# EAGLE design NTS2 (EAGLE 6.4)
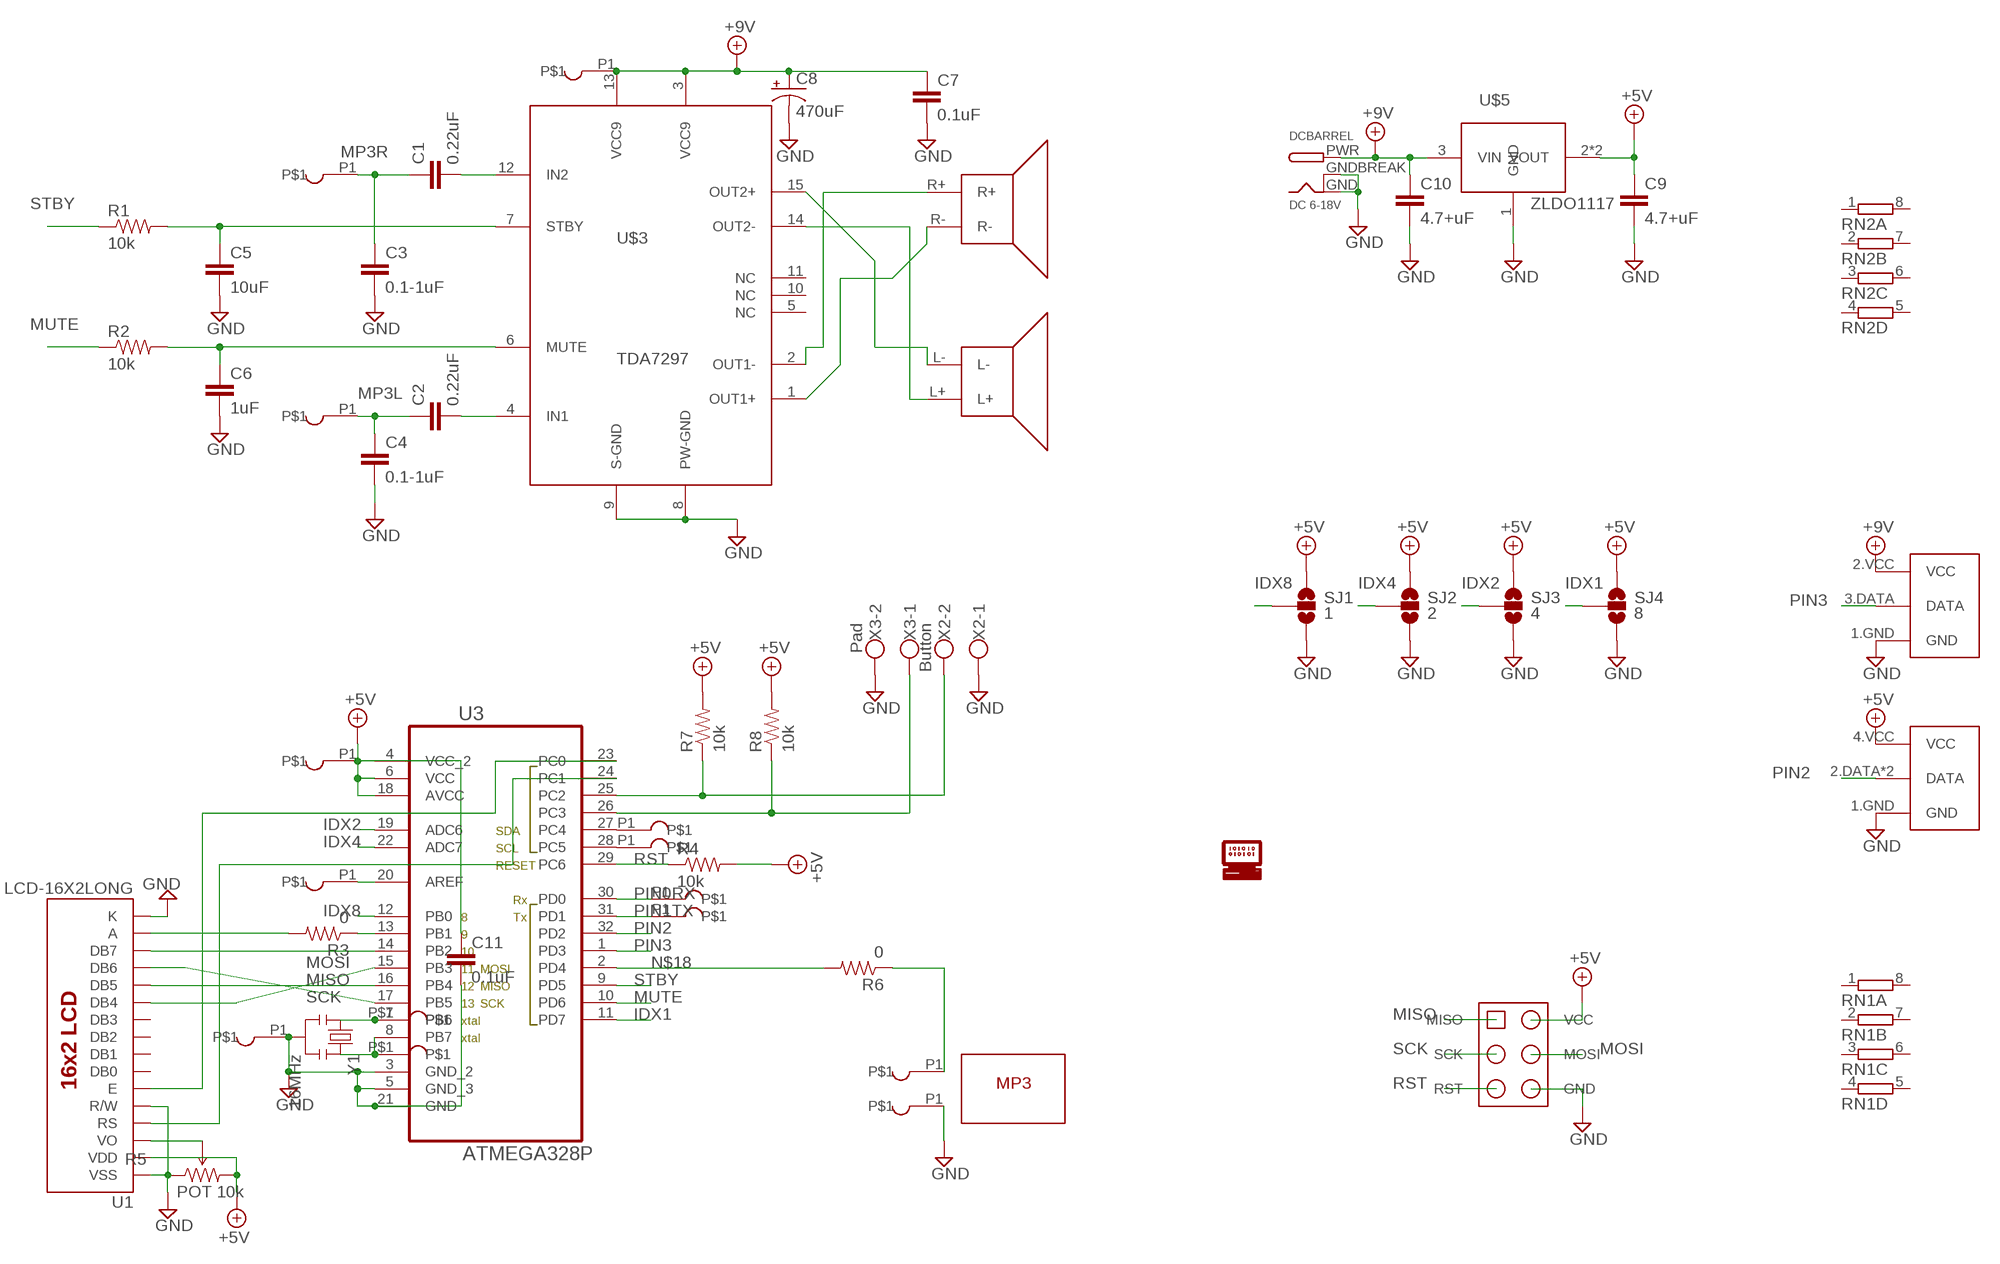
[diagram p0: schematic, sheet 1]

## Parts
AREF  AREF  PROTO-HOLENOSILK  [JMP1]
C1  0.22uF  CAP0805-XL  [0805-XL]
C2  0.22uF  CAP0805-XL  [0805-XL]
C3  0.1-1uF  CAP0805-XL  [0805-XL]
C4  0.1-1uF  CAP0805-XL  [0805-XL]
C5  10uF  CAP0805-XL  [0805-XL]
C6  1uF  CAP0805-XL  [0805-XL]
C7  0.1uF  CAP0805-XL  [0805-XL]
C8  470uF  CAP_POLHORR  [CAP-PTH-200-POL-HOR-R-600]
C9  4.7+uF  CAP1206  [1206]
C10  4.7+uF  CAP0805-XL  [0805-XL]
C11  0.1uF  CAP0805-XL  [0805-XL]
DCBARREL  DC 6-18V  DCBARRELPTH  [DCJACK_2MM_PTH]
GND  GND  PROTO-HOLENOSILK  [JMP1]
MP3+  M+  PROTO-HOLESILK-RECT  [JMP1-RECT]
MP3-  M-  PROTO-HOLESILK-RECT  [JMP1-RECT]
MP3-L  L  PROTO-HOLESILK-RECT  [JMP1-RECT]
MP3-R  R  PROTO-HOLESILK-RECT  [JMP1-RECT]
PB6  PB6  PROTO-HOLESMD100  [JMP1-SMD-100]
PB7  PB7  PROTO-HOLESMD100  [JMP1-SMD-100]
PC4  A4  PROTO-HOLENOSILK  [JMP1]
PC5  A5  PROTO-HOLENOSILK  [JMP1]
PD0  Rx  PROTO-HOLENOSILK  [JMP1]
PD1  Tx  PROTO-HOLENOSILK  [JMP1]
R1  10k  RESISTOR0805-XL  [0805-XL]
R2  10k  RESISTOR0805-XL  [0805-XL]
R3  0  RESISTOR1206  [1206]
R4  10k  RESISTOR0805-XL  [0805-XL]
R5  POT 10k  TRIMPOTPTH  [TRIM_POT_PTH]
R6  0  RESISTOR1206  [1206]
R7  10k  RESISTOR0805-XL  [0805-XL]
R8  10k  RESISTOR0805-XL  [0805-XL]
RN1  4R-NCAT16  [CAT16]
RN2  4R-N0402ARV341  [4X0402ARV341]
SJ1  1  JUMPER_2WAYBIN-PTH  [SJ_2_BIN-PTH]
SJ2  2  JUMPER_2WAYBIN-PTH  [SJ_2_BIN-PTH]
SJ3  4  JUMPER_2WAYBIN-PTH  [SJ_2_BIN-PTH]
SJ4  8  JUMPER_2WAYBIN-PTH  [SJ_2_BIN-PTH]
U1  LCD-16X2LONG  [LCD-16X2-LONG]
U3  ATMEGA328P  ATMEGA328P-AUQFP-LONG-DIA  [QFP80P900X900X120-32N-LD]
U$1  OUTLINE-MP3-MDM  [OUTLINE-MP3-MDM]
U$2  HEAD-2X3-ISPISP6NLL  [HEADER2X3-PTH-NOLABEL-LONG]
U$3  TDA7297  TDA7297-SINK  [TDA7297]
U$4  SPEAKERSPTH  [SPEAKER-5105]
U$5  ZLDO1117  VREGZLDO1117  [SOT223-3-L]
U$6  RF-TRANSMITTER  [RF-TRANSMIT]
U$7  RF-RECEIVER  [RF-RECEIVER]
U$8  LOGO_HM512  [LOGO_HM_512]
VCC  VCC  PROTO-HOLENOSILK  [JMP1]
VIN  Vin  PROTO-HOLENOSILK  [JMP1]
X2  Button  CON-SCREW2  [CON-SCREW2]
X3  Pad  CON-SCREW2  [CON-SCREW2]
Y1  16MHz  RESONATOR8MHZ  [SMD-RESONATOR-320-130-PRQC]

## Nets
+5V [VCC]: C9.1 C11.1 R4.2 R5.3(CW) R7.2 R8.2 SJ1.1 SJ2.1 SJ3.1 SJ4.1 U1.2(VDD) U3.4(VCC_2) U3.6(VCC) U3.18(AVCC) U$2.VCC U$5.2(VOUT) U$5.4(VOUT) U$7.4.VCC(VCC) VCC.P1
+9V [Vin]: C7.1 C8.2+(+) C10.1 DCBARREL.PWR U$3.3(VCC9) U$3.13(VCC9) U$5.3(VIN) U$6.2.VCC(VCC) VIN.P1
AREF: AREF.P1 U3.20(AREF)
GND [GROUND]: C3.2 C4.2 C5.2 C6.2 C7.2 C8.1-(-) C9.2 C10.2 C11.2 DCBARREL.GND DCBARREL.GNDBREAK GND.P1 MP3-.P1 R5.1(CCW) SJ1.3 SJ2.3 SJ3.3 SJ4.3 U1.1(VSS) U1.5(R/W) U1.16(K) U3.3(GND_2) U3.5(GND_3) U3.21(GND) U$2.GND U$3.8(PW-GND) U$3.9(S-GND) U$5.1(GND) U$6.1.GND(GND) U$7.1.GND(GND) X2.1 X3.2 Y1.2.GND
IDX1: SJ4.2(2.C) U3.11(PD7)
IDX2: SJ3.2(2.C) U3.19(ADC6)
IDX4: SJ2.2(2.C) U3.22(ADC7)
IDX8: SJ1.2(2.C) U3.12(PB0)
MISO: U1.12(DB5) U3.16(PB4) U$2.MISO
MOSI: U1.11(DB4) U3.15(PB3) U$2.MOSI
MP3L: C2.1 C4.1 MP3-L.P1
MP3R: C1.1 C3.1 MP3-R.P1
MUTE: R2.1 U3.10(PD6)
N$1 [Audio]: U$3.15(OUT2+) U$4.L-
N$2 [Audio]: U$3.14(OUT2-) U$4.L+
N$3 [Audio]: U$3.2(OUT1-) U$4.R+
N$4 [Audio]: U$3.1(OUT1+) U$4.R-
N$5: R7.1 U3.25(PC2) X2.2
N$6: C1.2 U$3.12(IN2)
N$7: R8.1 U3.26(PC3) X3.1
N$8: C2.2 U$3.4(IN1)
N$9: C6.1 R2.2 U$3.6(MUTE)
N$10: C5.1 R1.2 U$3.7(STBY)
N$11: R3.1 U3.13(PB1)
N$12: U1.14(DB7) U3.14(PB2)
N$13: PB6.P$1 U3.7(PB6) Y1.1
N$14: PB7.P$1 U3.8(PB7) Y1.3
N$15: R5.2(WIPER) U1.3(VO)
N$16: U1.6(E) U3.23(PC0)
N$17: U1.4(RS) U3.24(PC1)
N$18: R6.2 U3.2(PD4)
N$19: R3.2 U1.15(A)
N$20: MP3+.P1 R6.1
N$22: PC4.P1 U3.27(PC4)
N$23: PC5.P1 U3.28(PC5)
PIN0RX: PD0.P1 U3.30(PD0)
PIN1TX: PD1.P1 U3.31(PD1)
PIN2: U3.32(PD2) U$7.2.DATA(DATA) U$7.3.DATA(DATA)
PIN3: U3.1(PD3) U$6.3.DATA(DATA)
RST: R4.1 U3.29(PC6) U$2.RST
SCK: U1.13(DB6) U3.17(PB5) U$2.SCK
STBY: R1.1 U3.9(PD5)
Unconnected: RN1.1 RN1.2 RN1.3 RN1.4 RN1.5 RN1.6 RN1.7 RN1.8 RN2.1 RN2.2 RN2.3 RN2.4 RN2.5 RN2.6 RN2.7 RN2.8 U1.7(DB0) U1.8(DB1) U1.9(DB2) U1.10(DB3) U$3.5(NC) U$3.10(NC) U$3.11(NC)

## Library data of the parts
AREF GND MP3+ MP3- MP3-L MP3-R PB6 PB7 PC4 PC5 PD0 PD1 VCC VIN = Cano:PROTO-HOLE
C1-C7 C9-C11 = Cano:CAP: Capacitor Standard 0603 ceramic capacitor, and 0.1" leaded capacitor.
C8 = Cano:CAP_POL: Capacitor Polarized These are standard SMD and PTH capacitors. Normally 10uF, 47uF, and 100uF in electrolytic and tantalum varieties. Always verify the external diameter of the through hole cap, it varies with capacity, voltage, and manufacturer. The EIA devices should be standard.
DCBARREL = Cano:DCBARREL: 2.0mm DC Barrel Jack DCJACK_2MM_PTH - Through Hole Jack (4UConnector: 05537)
R1-R4 R6-R8 = Cano:RESISTOR: Resistor Basic schematic elements and footprints for 0603, 1206, and PTH resistors.
R5 = Cano:TRIMPOT: Various small potentiometers for "set-and-forget" applications
RN1 RN2 = resistor-dil:4R-N: Array Chip Resistor Source: RS Component / Phycomp; OC_FARNELL: unknown; OC_NEWARK: unknown
SJ1-SJ4 = Cano:JUMPER_2WAY: Solder Jumper 2 way solder jumper
U1 = Cano:LCD-16X2: Standard text-only 16x2 parallel input LCD
U3 = Cano:ATMEGA328P-AU: 8-bit Microcontroller with In-System Programmable Flash
U$1 = Cano:OUTLINE-MP3-MDM
U$2 = Cano:HEAD-2X3-ISP
U$3 = Cano:TDA7297
U$4 = Cano:SPEAKERS
U$5 = Cano:VREG
U$6 = Cano:RF-TRANSMITTER
U$7 = Cano:RF-RECEIVER
U$8 = Cano:LOGO_HM
X2 X3 = Cano:CON-SCREW2: WAGO SCREW CLAMP; MPN: 237-102; OC_FARNELL: unknown; OC_NEWARK: 70K9898
Y1 = Cano:RESONATOR: Resonator Small SMD resonator. Used, eg, on the Arduino Pro/ Pro Mini boards. 8MHz- XTAL-08895 16MHz- XTAL-08900; PROD_ID: XTAL-08895; VALUE: 8MHZ

## Net classes
1 GROUND: width 0.406 mm
2 VCC: width 0.406 mm
3 Vin: width 1.626 mm
4 Audio: width 0.813 mm, clearance 0.813 mm to class 0, clearance 0.813 mm to class 1, clearance 0.813 mm to class 2, clearance 0.813 mm to class 3, clearance 0.813 mm

## Board
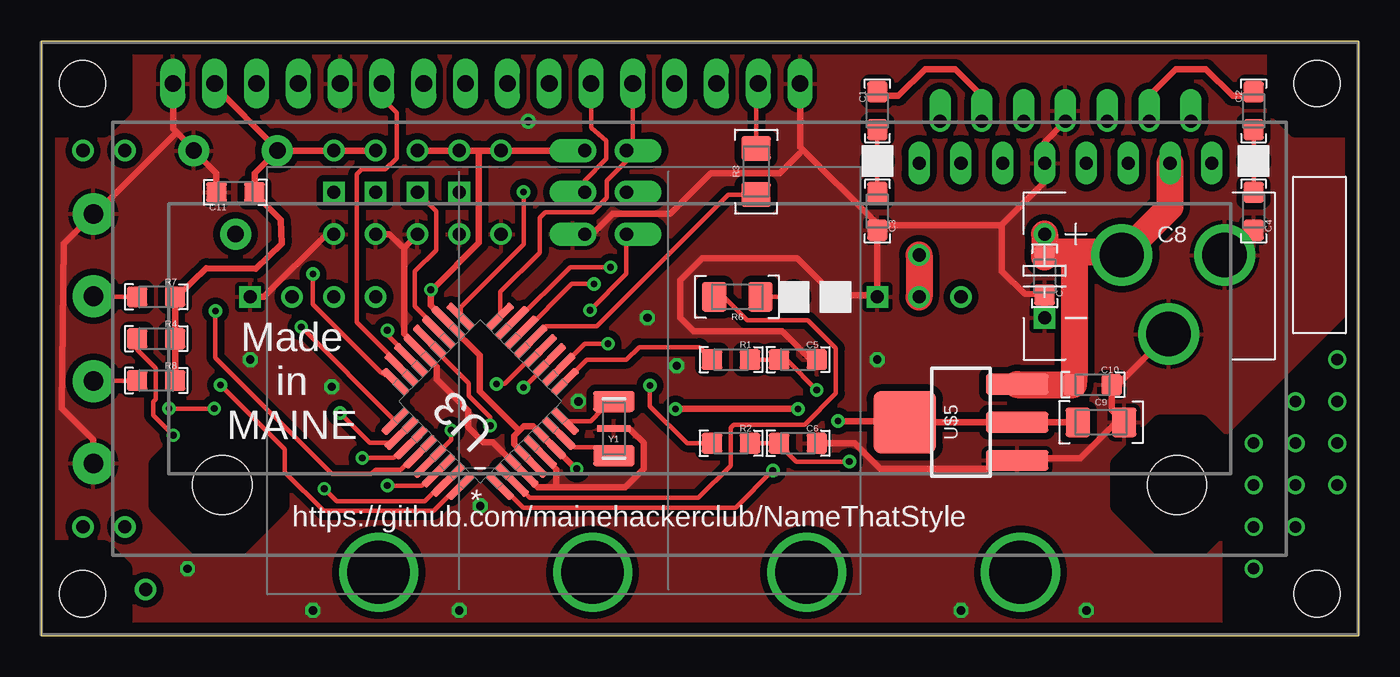
[diagram p1: board, top side]
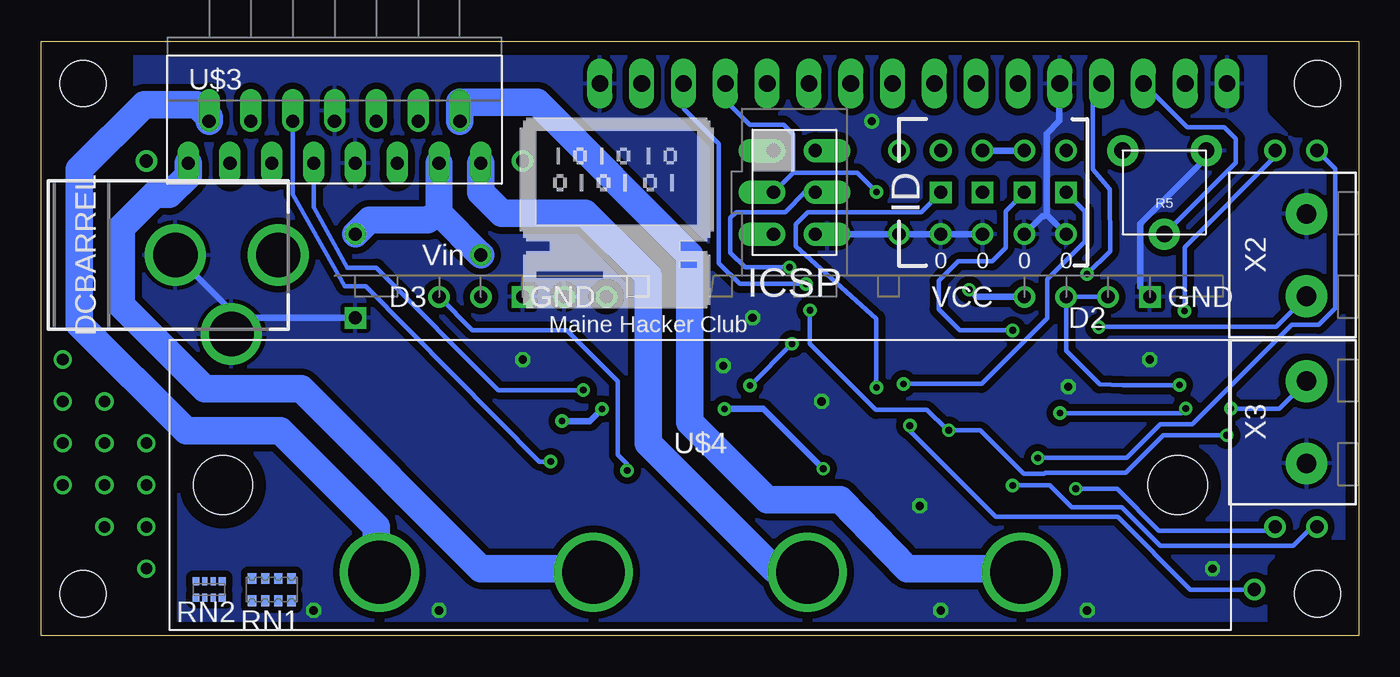
[diagram p2: board, bottom side, seen from below]

Size 80.05 x 36.11 mm. Coordinates in mm from the lower left corner, seen from the top.
Outline: 0,0 80.05,0 80.05,36.11 0,36.11 0,0
Copper layers (1*16): Top 0.035mm / dielectric 1.5mm / Bottom 0.035mm
Design rules "cano": minimum track width 11mil, minimum drill 16mil, track to track 12mil, track to pad 13mil, pad to pad 8mil, via to via 24mil, smd to smd 8mil, copper to edge 32mil, drill to drill 8mil, minimum pad ring 10mil, minimum via ring 8mil, stop-mask expansion 4mil, vias tented up to drill 0mil, thermal gap 10mil
tRestrict: area 72.4,0.3 to 80,19.3
bRestrict: area 72.4,0.3 to 80,19.3
vRestrict: area 35.6,18 to 52.1,32; area 14,5.8 to 67.3,8.4

### Footprints (pad centres in the part's own frame; a part is rotated, then mirrored left to right if it is on the bottom)
JMP1 = drill 0.8: P1 0,0
0805-XL = smd 1.27 x 1.27: 1 -1.154,0; 2 1.154,0
CAP-PTH-200-POL-HOR-R-600 = drill 0.8 square: 1- -5.08,-2.54 | drill 0.8: 2+ -5.08,2.54
1206 = smd 1.5 x 1.8: 1 -1.4,0; 2 1.4,0
DCJACK_2MM_PTH = drill 2.7: GND 0,-0.27; GNDBREAK 4.8,3.13; PWR 0,5.98
JMP1-RECT = drill 0.8: P1 0,0
JMP1-SMD-100 = smd 2.54 x 1.27: P$1 0,0
TRIM_POT_PTH = drill 1 pad 1.88: 1 -2.54,-2.54; 2 0,2.54; 3 2.54,-2.54
CAT16 = smd 0.5 x 0.65: 1 -1.2,-0.675; 2 -0.4,-0.675; 3 0.4,-0.675; 4 1.2,-0.675; 5 1.2,0.675; 6 0.4,0.675; 7 -0.4,0.675; 8 -1.2,0.675
4X0402ARV341 = smd 0.4 x 0.5: 1 -0.8,-0.5; 4 0.8,-0.5; 5 0.8,0.5; 8 -0.8,0.5 | smd 0.3 x 0.5: 2 -0.25,-0.5; 3 0.25,-0.5; 6 0.25,0.5; 7 -0.25,0.5
SJ_2_BIN-PTH = drill 0.8: 1 0,2.54; 3 0,-2.54 | drill 0.8 square: 2 0,0
LCD-16X2-LONG = drill 1.016 long: 1 -32,15.5; 2 -29.46,15.5; 3 -26.92,15.5; 4 -24.38,15.5; 5 -21.84,15.5; 6 -19.3,15.5; 7 -16.76,15.5; 8 -14.22,15.5; 9 -11.68,15.5; 10 -9.14,15.5; 11 -6.6,15.5; 12 -4.06,15.5; 13 -1.52,15.5; 14 1.02,15.5; 15 3.56,15.5; 16 6.1,15.5 | hole 2.8: -37.5,15.5; -37.5,-15.5; 37.5,15.5; 37.5,-15.5
QFP80P900X900X120-32N-LD = smd 2.032 x 0.457: 1 -4.496,2.794; 8 -4.496,-2.794; 17 4.496,-2.794; 24 4.496,2.794 | smd 2.54 x 0.457: 2 -4.75,2.007; 3 -4.75,1.194; 4 -4.75,0.406; 5 -4.75,-0.406; 6 -4.75,-1.194; 7 -4.75,-2.007; 18 4.75,-2.007; 19 4.75,-1.194; 20 4.75,-0.406; 21 4.75,0.406; 22 4.75,1.194; 23 4.75,2.007 | smd 0.457 x 2.032: 9 -2.794,-4.496; 16 2.794,-4.496; 25 2.794,4.496; 32 -2.794,4.496 | smd 0.457 x 2.54: 10 -2.007,-4.75; 11 -1.194,-4.75; 12 -0.406,-4.75; 13 0.406,-4.75; 14 1.194,-4.75; 15 2.007,-4.75; 26 2.007,4.75; 27 1.194,4.75; 28 0.406,4.75; 29 -0.406,4.75; 30 -1.194,4.75; 31 -2.007,4.75
HEADER2X3-PTH-NOLABEL-LONG = drill 0.8 pad 1.422 offset: GND 1.27,-2.54; MISO -1.27,2.54; MOSI 1.27,0; RST -1.27,-2.54; SCK -1.27,0; VCC 1.27,2.54
TDA7297 = drill 0.8 long: 1 2.54,-8.89; 3 2.54,-6.35; 5 2.54,-3.81; 7 2.54,-1.27; 9 2.54,1.27; 11 2.54,3.81; 13 2.54,6.35; 15 2.54,8.89 | drill 0.8 offset: 2 0,-7.62; 4 0,-5.08; 6 0,-2.54; 8 0,0; 10 0,2.54; 12 0,5.08; 14 0,7.62
SPEAKER-5105 = drill 3.8: L+ -19.5,5.3; L- -6.5,5.3; R+ 19.5,5.3; R- 6.5,5.3 | hole 3.6: 29,0; -29,0
SOT223-3-L = smd 1.27 x 3.81: 1 -2.311,-3.417; 2 0,-3.417; 3 2.311,-3.417 | smd 3.81 x 3.81: 4 0,3.417
RF-TRANSMIT = drill 0.8 square: 1.GND -2.54,0 | drill 0.8: 2.VCC 0,0; 3.DATA 2.54,0
RF-RECEIVER = drill 0.8 square: 1.GND -11.43,0 | drill 0.8: 2.DATA -8.89,0; 3.DATA -6.35,0; 4.VCC -3.81,0
CON-SCREW2 = drill 1.194 pad 2.54: 1 -2.5,0; 2 2.5,0
SMD-RESONATOR-320-130-PRQC = smd 0.4 x 2: 1 -1.2,0; 2.GND 0,0; 3 1.2,0

### Placement (x,y rotation side)
AREF  6.35,2.79 0 top
C1  50.8,31.88 90 top
C2  73.66,31.88 90 top
C3  50.8,25.78 270 top
C4  73.66,25.78 270 top
C5  45.97,16.76 0 top
C6  45.97,11.68 0 top
C7  60.96,21.84 270 top
C8  66.04,21.84 0 top
C9  64.39,12.95 0 top
C10  63.88,15.24 0 top
C11  11.81,26.92 180 top
DCBARREL  71.63,23.11 270 bottom
GND  27.94,24.38 270 top
MP3+  45.72,20.57 90 top
MP3-  48.26,20.57 90 top
MP3-L  73.66,28.83 0 top
MP3-R  50.8,28.83 180 top
PB6  34.8,10.92 0 top
PB7  34.8,14.22 0 top
PC4  2.54,29.46 90 top
PC5  5.08,29.46 90 top
PD0  2.54,6.6 270 top
PD1  5.08,6.6 270 top
R1  41.91,16.76 0 top
R2  41.91,11.68 0 top
R3  43.43,28.19 90 top
R4  6.99,18.03 0 top
R5  11.81,26.92 180 bottom
R6  42.29,20.57 180 top
R7  6.99,20.57 0 top
R8  6.99,15.49 0 top
RN1  66.04,2.79 0 bottom
RN2  69.85,2.79 0 bottom
SJ1  17.78,26.92 0 bottom
SJ2  20.32,26.92 0 bottom
SJ3  22.86,26.92 0 bottom
SJ4  25.4,26.92 0 bottom
U1  40.01,18.03 0 top
U3  26.67,14.22 135 top
U$1  31.75,15.49 180 top
U$2  34.29,26.92 0 bottom
U$3  62.23,31.24 270 bottom
U$4  40.01,9.14 180 bottom
U$5  55.88,12.95 90 top
U$6  53.34,20.57 180 bottom
U$7  24.13,20.57 180 bottom
U$8  45.21,25.65 0 bottom
VCC  27.94,29.46 270 top
VIN  53.34,23.11 90 top
X2  3.17,23.11 270 bottom
X3  3.17,12.95 270 bottom
Y1  34.8,12.57 90 top

### Tracks (layer width: path | path; a pad name or v marks a point on that pad's centre or on a via)
+5V  (via drill 0.41)
  Top 0.406: SJ2.1 SJ1.1 R5.3 | SJ3.1 SJ4.1 26.59,29.46 | 26.59,29.46 VCC.P1 U$2.VCC | R8.2 8.15,15.49 8.15,18.03 R4.2 8.15,18.21 8.15,20.57 R7.2 8.33,20.68 10.03,22.33 13.03,22.28 14.61,23.8 14.55,25.27 13.08,26.75 C11.1 12.98,26.92 12.98,28.09 R5.3 | U1.2 10.57,33.53 10.57,33.32 14.25,29.64 R5.3 | C9.1 U$5.2 U$5.4 52.27,13.03 v48.41,13.03 | 29.05,12.43 29.31,12.7 29.9,12.7 30.86,11.73 U3.6 31.04,11.58 32.49,10.13 v32.54,10.13 | 29.05,12.43 28.75,12.14 28.75,11.63 29.72,10.67 29.72,10.59 U3.4 | 29.05,12.43 26.64,14.83 26.64,17.02 24.74,18.92 U3.18 24.59,19.15 23.67,20.07 v23.67,21.01 23.85,21.11 26.59,23.85 26.59,29.46 | v38.53,13.77 v45.97,13.77
  Bottom 0.406: SJ3.1 SJ2.1 | U$7.4.VCC 23.24,20.57 v23.67,21.01 | v48.41,13.03 46.71,13.03 v45.97,13.77 | v38.53,13.77 36.17,13.77 v32.54,10.13
+9V
  Top 1.626: VIN.P1 U$6.2.VCC | 62.71,15.24 59.31,15.24 U$5.3 | 62.71,15.24 C10.1 | C8.2+ 60.96,23.29 | 60.96,23.29 C7.1 | U$3.3 68.58,26.04 DCBARREL.PWR 64.85,23.29 62.76,23.29 | 62.76,23.29 60.96,23.29 | 62.76,23.29 62.76,16.03 62.71,15.24
  Bottom 1.626: 55.88,25.65 U$3.13 | VIN.P1 55.88,25.65 | C8.2+ 60.1,25.25 56.59,25.25 55.88,25.65
AREF  (via drill 0.41)
  Top 0.279: v27.28,12.75 27.28,13.26 25.98,14.55 25.98,15.34 23.62,17.7 23.62,17.86 U3.20
  Bottom 0.279: v27.28,12.75 27.33,12.5 22.05,7.21 14.66,7.21 10.24,2.79 AREF.P1
GND  (via drill 0.5)
  Top 0.406: C5.2 46.76,16.76 45.03,18.49 39.65,18.49 38.84,19.3 38.84,21.59 40.16,22.91 45.92,22.91 MP3-.P1 48.44,20.68 50.62,20.68 U$6.1.GND C3.2 | 46.13,29.67 46.13,33.53 U1.16 | 46.13,29.67 50.72,25.07 C3.2 | C4.2 73.66,24.87 DCBARREL.GND | C6.2 49.43,11.68 50.98,10.13 57.51,10.13 59.28,10.64 U$5.1 | 59.31,10.67 U$5.1 | U$3.8 60.96,29.97 U$3.9 60.86,28.52 60.86,27.43 58.37,24.94 | C8.1- C7.2 59.74,20.75 58.37,22.12 58.37,24.94 | DCBARREL.GNDBREAK 68.48,18.31 65.51,15.34 65.23,15.34 C10.2 65.05,15.24 65.05,13.69 C9.2 65.41,13.06 63.12,10.77 59.49,10.77 U$5.1 | C3.2 51,24.92 58.19,24.92 58.37,24.94 | C11.2 10.64,26.92 10.64,28.09 R5.1 9.17,29.64 8.24,30.57 | 8.24,30.57 8.03,30.79 8.03,33.53 U1.1 | X3.2 3.17,11.89 1.25,13.82 1.37,23.8 X2.1 3.35,25.68 8.24,30.57 | U$7.1.GND 13.54,20.57 17.35,24.38 SJ1.3 | Y1.2.GND 35.74,12.57 36.6,11.71 36.6,10.13 35.48,9.02 31.29,9.02 | 31.29,9.02 30.18,9.02 29.18,10.01 U3.3 29.03,10.13 27.43,11.73 26.85,11.73 25.93,12.65 25.93,13.66 24.03,15.57 24.03,16.33 23.19,17.17 U3.21 23.01,17.37 22.05,18.34 22.05,23.57 | 31.29,9.02 31.29,10.11 30.33,11.07 U3.5 | SJ3.3 22.05,23.57 | SJ2.3 21.16,24.38 21.87,23.67 22.05,23.57 | U$2.GND 33.48,24.38 34.72,25.63 38.23,25.63 40.69,28.09 44.88,28.09 46.23,29.44 46.2,29.57 46.13,29.67
  Bottom 0.406: C8.1- 67.51,19.3 68.48,18.34 DCBARREL.GNDBREAK 67.92,19.15 71.88,23.11 DCBARREL.GND | 18.97,25.58 18.97,30.48 18.19,31.27 18.19,33.53 U1.5 | SJ1.3 18.97,25.58 | SJ3.3 SJ4.3 GND.P1 U$2.GND | SJ2.3 19.23,25.48 19.15,25.48 18.97,25.58 | R5.1 9.27,29.03 13.28,25.02 13.28,21.16 U$7.1.GND
  other vias: 16.51,1.52 63.5,1.52 29.59,31.24 36.83,19.3 12.7,16.76 17.65,15.11 26.67,7.87 55.88,1.52 25.4,1.52 50.8,16.76 8.89,4.06 38.61,16.38 32.64,14.22
  pour Top (isolate 0.406): 0,0.25 80.01,0.25 80.01,35.81 0,35.81
  pour Bottom (isolate 0.406): 0,0.25 80.01,0.25 80.01,35.81 0,35.81
IDX1  (via drill 0.41)
  Top 0.279: v29.31,15.06 30.86,16.61 30.86,16.71 U3.11
  Bottom 0.279: v29.31,15.06 29.31,19.25 34.21,23.65 34.21,24.99 33.48,25.73 26.59,25.73 SJ4.2
IDX2
  Top 0.279: SJ3.2 24,25.78 24,23.42 22.71,22.12 22.71,20.02 24.16,18.57 24.16,18.44 U3.19
IDX4  (via drill 0.41)
  Top 0.279: v21.03,18.54 21.03,18.29 22.45,16.87 22.45,16.74 U3.22
  Bottom 0.279: v21.03,18.54 24.23,18.54 25.53,19.84 25.53,21.54 24.33,22.73 22.28,22.73 21.46,23.55 21.46,25.78 SJ2.2
IDX8  (via drill 0.41)
  Top 0.279: v27.66,15.29 28.17,15.29 30.15,17.27 30.3,17.27 U3.12
  Bottom 0.279: v27.66,15.29 22.91,15.29 18.92,19.28 18.92,21.64 16.64,23.93 16.64,25.78 SJ1.2
MISO
  Top 0.279: U3.16 27.89,19.38 27.89,20.88 30.28,23.27 30.28,25.38 30.63,25.73 33.5,25.73 34.37,26.59 34.37,27.64 35.56,28.83 U$2.MISO 35.61,29.59 35.94,29.92 U1.12
MOSI  (via drill 0.41)
  Top 0.279: v34.59,22.38 32.13,22.38 28.78,19.03 28.63,19.03 U3.15 | U$2.MOSI 33.02,27.64 34.34,28.96 34.34,30.07 33.43,30.86 33.43,33.53 U1.11
  Bottom 0.279: v34.59,22.38 37.29,22.38 38.18,23.27 38.18,25.38 37.82,25.73 34.85,25.73 33.66,26.92 U$2.MOSI
MP3L
  Top 0.279: C4.1 MP3-L.P1 C2.1
MP3R
  Top 0.279: C3.1 MP3-R.P1 C1.1
MUTE  (via drill 0.41)
  Top 0.279: R2.1 39.24,11.68 36.98,13.95 v36.98,15.19 | v34.44,17.73 33.02,17.73 31.47,16.18 U3.10
  Bottom 0.279: v34.44,17.73 v36.98,15.19
N$1
  Bottom 1.676: U$3.15 53.34,26.92 52.07,25.65 46.99,25.65 43.18,21.84 43.18,11.68 35.56,4.06 33.73,4.06 U$4.L-
N$2
  Bottom 1.676: U$3.14 54.61,32.38 49.91,32.38 40.64,23.11 40.64,12.95 35.94,8.25 31.5,8.25 27.43,4.06 20.73,4.06 U$4.L+
N$3
  Bottom 1.676: U$3.2 69.85,31.5 70.61,32.26 73.79,32.26 77.72,28.32 77.72,18.92 71.25,12.45 65.53,12.45 59.69,6.6 59.69,4.03 U$4.R+
N$4
  Bottom 1.676: U$3.1 71.12,27.94 72.26,26.8 73.15,26.8 75.18,24.77 75.18,20.07 70.1,14.99 64.26,14.99 53.34,4.06 46.73,4.06 U$4.R-
N$5  (via drill 0.41)
  Top 0.279: R7.1 3.2,20.57 3.17,20.6 X2.2 | v15.8,18.75 U3.25
  Bottom 0.279: v15.8,18.75 5.03,18.75 3.17,20.6 X2.2
N$6
  Top 0.279: U$3.12 57.28,32.66 | 50.8,32.79 C1.2
  Top 0.406: 50.8,32.79 52.07,32.79 53.7,34.42 55.52,34.42 57.28,32.66
N$7  (via drill 0.41)
  Top 0.279: R8.1 3.2,15.49 3.17,15.47 X3.1 | v18.16,13.51 19.96,11.71 21.21,11.71 21.77,12.27 21.87,12.27 U3.26 | v7.77,13.79 v10.52,13.79
  Bottom 0.279: v18.16,13.51 10.79,13.51 v10.52,13.79 | v7.77,13.79 4.83,13.79 X3.1
N$8
  Top 0.279: U$3.4 67.31,32.79 | 73.66,32.79 C2.2
  Top 0.406: 73.66,32.79 72.39,32.79 70.76,34.42 68.94,34.42 67.31,32.79
N$9  (via drill 0.41)
  Top 0.279: R2.2 C6.1 44.96,11.63 45.06,11.38 45.87,10.57 v49.1,10.57
  Bottom 0.279: v49.1,10.57 49.78,10.57 60.33,21.21 61.59,21.21 64.77,26.82 U$3.6
N$10  (via drill 0.41)
  Top 0.279: R1.2 C5.1 44.96,16.71 45.31,16.71 v47.12,14.91
  Bottom 0.279: v47.12,14.91 52.27,14.91 59.69,22.35 61.47,22.35 63.5,26.01 U$3.7
N$11
  Top 0.279: R3.1 43.43,26.77 41.73,26.77 33.76,18.8 30.66,18.8 U3.13
N$12  (via drill 0.41)
  Top 0.279: v33.58,21.36 32.23,21.36 29.31,18.44 29.18,18.44 U3.14
  Bottom 0.279: v33.58,21.36 37.62,21.36 38.89,22.63 38.89,29.87 41.02,32 U1.14
N$13
  Top 0.279: PB6.P$1 Y1.1 34.67,11.43 32.41,11.43 31.57,12.27 31.47,12.27 U3.7
N$14
  Top 0.279: PB7.P$1 Y1.3 34.67,13.72 34.06,13.72 33.38,13.03 U3.8
N$15
  Bottom 0.279: R5.2 7.47,28.73 7.47,30.18 8.18,30.89 10.44,30.89 U1.3
N$16
  Top 0.279: U3.23 21.87,16.18 21.87,16.33 19.18,19.03 19.18,28.02 19.48,28.32 20.9,28.32 21.59,29.01 21.59,31.78 20.73,32.64 U1.6
N$17  (via drill 0.41)
  Top 0.279: v16.51,21.97 16.51,20.12 20.68,15.95 21.51,15.44 U3.24
  Bottom 0.279: v16.51,21.97 15.11,23.34 15.14,27.13 16.15,28.32 16.15,32.77 U1.4
N$18
  Top 0.279: R6.2 41.48,20.57 42.9,19.15 46.58,19.15 48.28,17.45 48.28,14.71 46.38,12.8 42.06,12.8 41.88,12.62 41.88,10.31 39.93,8.36 29.69,8.36 28.63,9.42 U3.2
N$19
  Top 0.279: R3.2 43.43,33.4 U1.15
N$20
  Top 0.279: MP3+.P1 R6.1
N$21  (via drill 0.7)
  other vias: 73.66,4.06
N$22  (via drill 0.41)
  Top 0.279: v19.51,10.79 21.41,10.79 22.33,11.71 22.45,11.71 U3.27
  Bottom 0.279: v19.51,10.79 14.1,10.79 12.06,12.83 10.11,12.83 4.06,18.87 2.44,18.87 1.42,19.89 1.42,28.35 PC4.P1
N$23  (via drill 0.41)
  Top 0.279: v10.59,19.71 10.59,16.89 17.65,9.83 20.07,9.83 20.32,10.08 21.84,10.08 22.91,11.15 U3.28
  Bottom 0.279: v10.59,19.71 10.59,23.6 5.08,29.11 PC5.P1
N$24  (via drill 0.7)
  other vias: 78.74,14.22
N$25  (via drill 0.7)
  other vias: 78.74,11.68
N$26  (via drill 0.7)
  other vias: 78.74,9.14
N$28  (via drill 0.7)
  other vias: 76.2,6.6
N$29  (via drill 0.7)
  other vias: 76.2,9.14
N$30  (via drill 0.7)
  other vias: 76.2,11.68
N$31  (via drill 0.7)
  other vias: 76.2,14.22
N$32  (via drill 0.7)
  other vias: 73.66,6.6
N$33  (via drill 0.7)
  other vias: 73.66,9.14
N$34  (via drill 0.7)
  other vias: 73.66,11.68
N$35  (via drill 0.7)
  other vias: 78.74,16.76
PIN0RX  (via drill 0.41)
  Top 0.279: v21.03,9.12 21.06,9.09 23.11,9.09 24.03,10.01 24.16,10.01 U3.30
  Bottom 0.279: v21.03,9.12 18.77,9.12 17.45,7.8 14.4,7.8 12.06,5.46 3.99,5.46 2.85,6.6 PD0.P1
PIN1TX  (via drill 0.41)
  Top 0.279: v17.2,8.91 17.96,8.15 23.29,8.15 24.56,9.42 24.71,9.42 U3.31
  Bottom 0.279: v17.2,8.91 14.68,8.91 12.14,6.38 5.31,6.38 PD1.P1
PIN2  (via drill 0.41)
  Top 0.279: v10.9,15.21 14.81,11.3 14.81,9.93 17.17,7.57 23.85,7.57 25.35,9.07 25.45,9.07 U3.32
  Bottom 0.279: v10.9,15.21 14.35,15.21 15.75,15.26 17.78,17.3 U$7.3.DATA U$7.2.DATA
PIN3  (via drill 0.41)
  Top 0.279: v44.45,10.03 42.19,7.77 29.29,7.77 27.99,9.07 27.89,9.07 U3.1
  Bottom 0.279: v44.45,10.03 44.45,10.41 45.01,10.97 45.01,15.44 48.11,18.54 53.85,18.54 U$6.3.DATA
RST  (via drill 0.41)
  Top 0.279: v8.03,12.17 6.81,13.39 6.81,14.2 6.96,14.35 6.96,16.23 5.84,17.35 5.84,18.03 R4.1 | v24.92,12.47 24.92,11.89 23.62,10.59 U3.29 | U$2.RST 35.56,21.97 v33.35,19.76
  Bottom 0.279: v8.03,12.17 11.89,12.17 14.17,9.88 19.05,9.88 19.1,9.83 20.37,9.83 23.01,12.47 v24.92,12.47 25.04,12.52 26.24,13.72 29.34,13.72 33.35,17.73 v33.35,19.76
SCK  (via drill 0.41)
  Top 0.279: v29.31,26.95 29.31,23.77 25.48,19.94 U3.17
  Bottom 0.279: v29.31,26.95 30.48,28.12 34.37,28.12 | U$2.SCK 34.37,28.12 | 34.37,28.12 34.37,30.46 34.95,31.04 37.01,31.04 38.48,32.51 U1.13
STBY
  Top 0.279: R1.1 40.01,17.53 36.32,17.53 35.56,16.76 33.15,16.76 31.83,15.44 U3.9

### Text on the board
tPlace: Made / in / MAINE | https://github.com/mainehackerclub/NameThatStyle
bPlace: ID | Vin | ICSP | D3 | D2 | Maine Hacker Club